# Altium schematic sheet cpu.SchDoc: Zillion - Z80 Single Board Computer
size A4; Author: Francesco Sacco; Revision: 0; ProjectName: Zillion - Z80 Single Board Computer
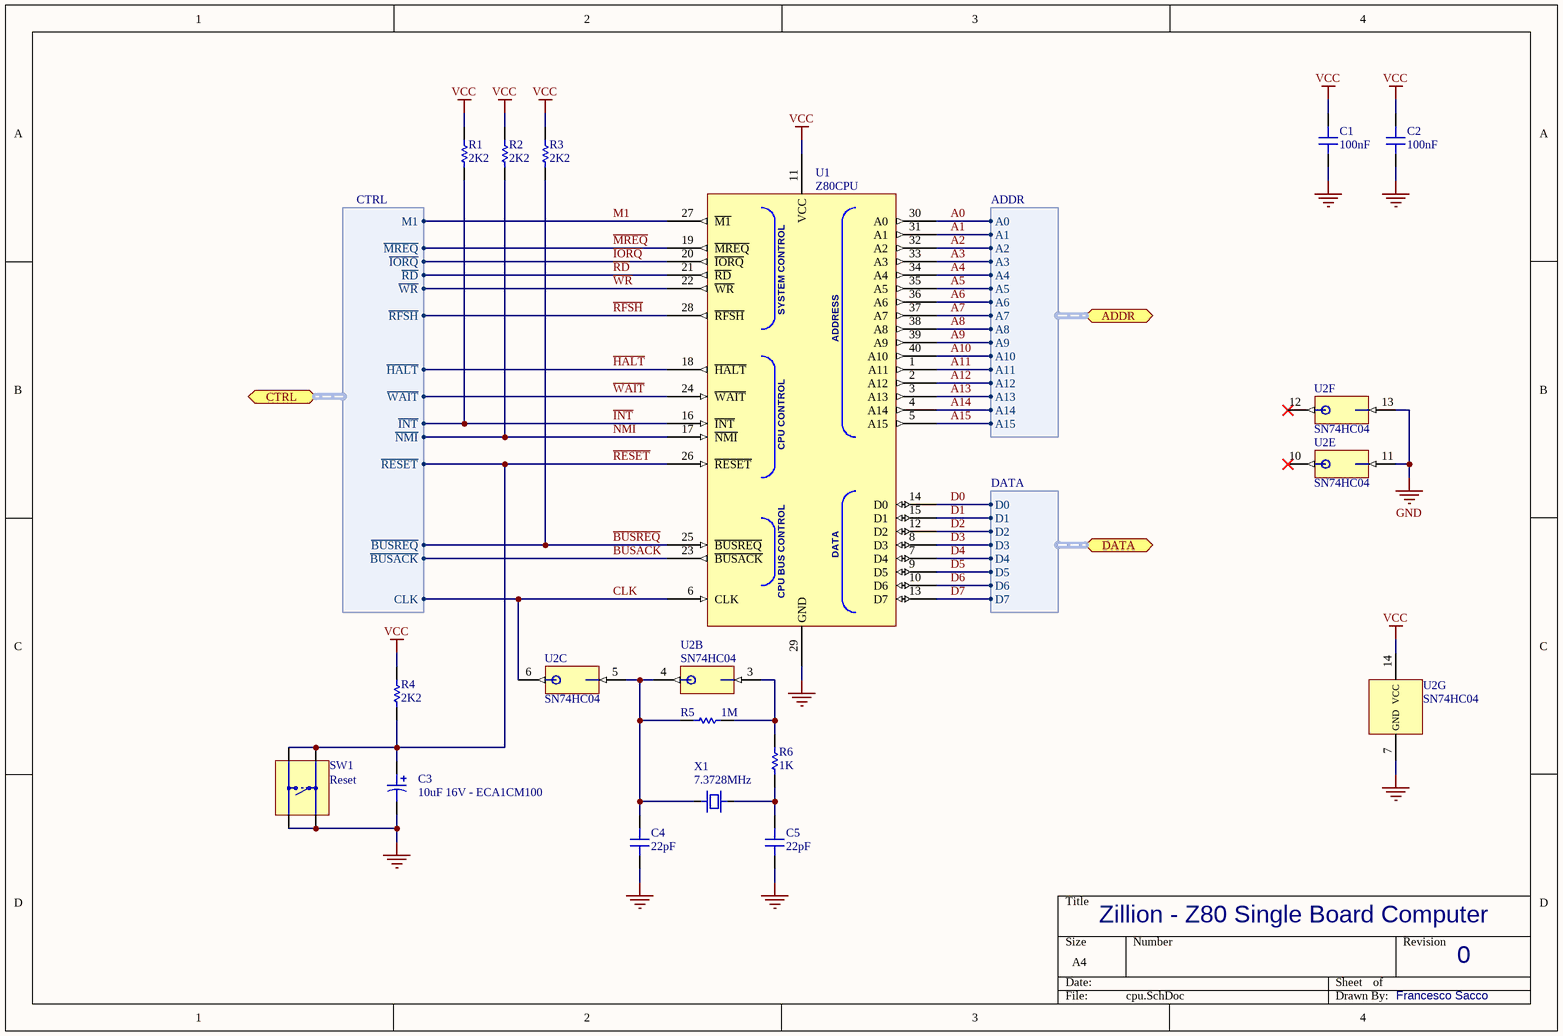
[diagram p0: cpu.SchDoc]

## Parts
C1  100nF  [DiskCapacitor]
C2  100nF  [DiskCapacitor]
C3  10uF 16V - ECA1CM100  [ECA 5x11]
C4  22pF  [DiskCapacitor]
C5  22pF  [DiskCapacitor]
R1  2K2  [CR12]
R2  2K2  [CR12]
R3  2K2  [CR12]
R4  2K2  [CR12]
R5  1M  [CR12]
R6  1K  [CR12]
SW1  Reset  [EVQPAx09K]
U1  Z80CPU  [Z84C00xxPEG]
U2  SN74HC04  [CDIP14]  (parts B,C,E,F,G of 7)
X1  7.3728MHz  [HC49S]

## Ports
ADDR (harness ADDR), CTRL (harness CTRL), DATA (harness DATA)

## Harnesses
ADDR: A0, A1, A2, A3, A4, A5, A6, A7, A8, A9, A10, A11, A12, A13, A14, A15
DATA: D0, D1, D2, D3, D4, D5, D6, D7
CTRL: M1, ~{MREQ}, ~{IORQ}, ~{RD}, ~{WR}, ~{RFSH}, ~{HALT}, ~{WAIT}, ~{INT}, ~{NMI}, ~{RESET}, ~{BUSREQ}, ~{BUSACK}, CLK

## Nets
GND: C1.1 C2.1 C3.2 C4.1 C5.1 SW1.1 SW1.2 U1.29(GND) U2.7(GND) U2.11(A) U2.13(A)
VCC: C1.2 C2.2 R1.2 R2.2 R3.2 R4.2 U1.11(VCC) U2.14(VCC)
A0: U1.30(A0) ; port ADDR.A0
A1: U1.31(A1) ; port ADDR.A1
A2: U1.32(A2) ; port ADDR.A2
A3: U1.33(A3) ; port ADDR.A3
A4: U1.34(A4) ; port ADDR.A4
A5: U1.35(A5) ; port ADDR.A5
A6: U1.36(A6) ; port ADDR.A6
A7: U1.37(A7) ; port ADDR.A7
A8: U1.38(A8) ; port ADDR.A8
A9: U1.39(A9) ; port ADDR.A9
A10: U1.40(A10) ; port ADDR.A10
A11: U1.1(A11) ; port ADDR.A11
A12: U1.2(A12) ; port ADDR.A12
A13: U1.3(A13) ; port ADDR.A13
A14: U1.4(A14) ; port ADDR.A14
A15: U1.5(A15) ; port ADDR.A15
~{BUSACK}: U1.23(~{BUSACK}) ; port CTRL.~{BUSACK}
~{BUSREQ}: R3.1 U1.25(~{BUSREQ}) ; port CTRL.~{BUSREQ}
CLK: U1.6(CLK) U2.6(Y) ; port CTRL.CLK
D0: U1.14(D0) ; port DATA.D0
D1: U1.15(D1) ; port DATA.D1
D2: U1.12(D2) ; port DATA.D2
D3: U1.8(D3) ; port DATA.D3
D4: U1.7(D4) ; port DATA.D4
D5: U1.9(D5) ; port DATA.D5
D6: U1.10(D6) ; port DATA.D6
D7: U1.13(D7) ; port DATA.D7
~{HALT}: U1.18(~{HALT}) ; port CTRL.~{HALT}
~{INT}: R1.1 U1.16(~{INT}) ; port CTRL.~{INT}
~{IORQ}: U1.20(~{IORQ}) ; port CTRL.~{IORQ}
M1: U1.27(~{M1}) ; port CTRL.M1
~{MREQ}: U1.19(~{MREQ}) ; port CTRL.~{MREQ}
~{NMI}: R2.1 U1.17(~{NMI}) ; port CTRL.~{NMI}
~{RD}: U1.21(~{RD}) ; port CTRL.~{RD}
~{RESET}: C3.1 R4.1 SW1.3 SW1.4 U1.26(~{RESET}) ; port CTRL.~{RESET}
~{RFSH}: U1.28(~{RFSH}) ; port CTRL.~{RFSH}
~{WAIT}: U1.24(~{WAIT}) ; port CTRL.~{WAIT}
~{WR}: U1.22(~{WR}) ; port CTRL.~{WR}
NetC4_2: C4.2 R5.2 U2.4(Y) U2.5(A) X1.1
NetC5_2: C5.2 R6.1 X1.2
NetR5_1: R5.1 R6.2 U2.3(A)

Not connected (* = marked no-connect by the designer): U2 10(Y)* 12(Y)*

## Notes on the sheet
- (in symbol Z84C00xxPEG) SYSTEM CONTROL; ADDRESS; CPU CONTROL; DATA; CPU BUS CONTROL

## Library data of the parts
C1 C2 C4 C5 = Capacitor
C3 = ECA1CM100: 10uF 16V
R1-R4 = Resistor
R5 R6 = Resistor: 2K2
SW1 = EVQPA: 5N Type Light Touch Switches
U1 = Z84C00xxPEG: Z80 - CPU
U2 = SN74HC04: Hex Inverters
X1 = HC49S: Crystal HC49S